# Altium schematic sheet Clock_Led7_23.SchDoc
size A3; SheetNumber: 1; SheetTotal: 1
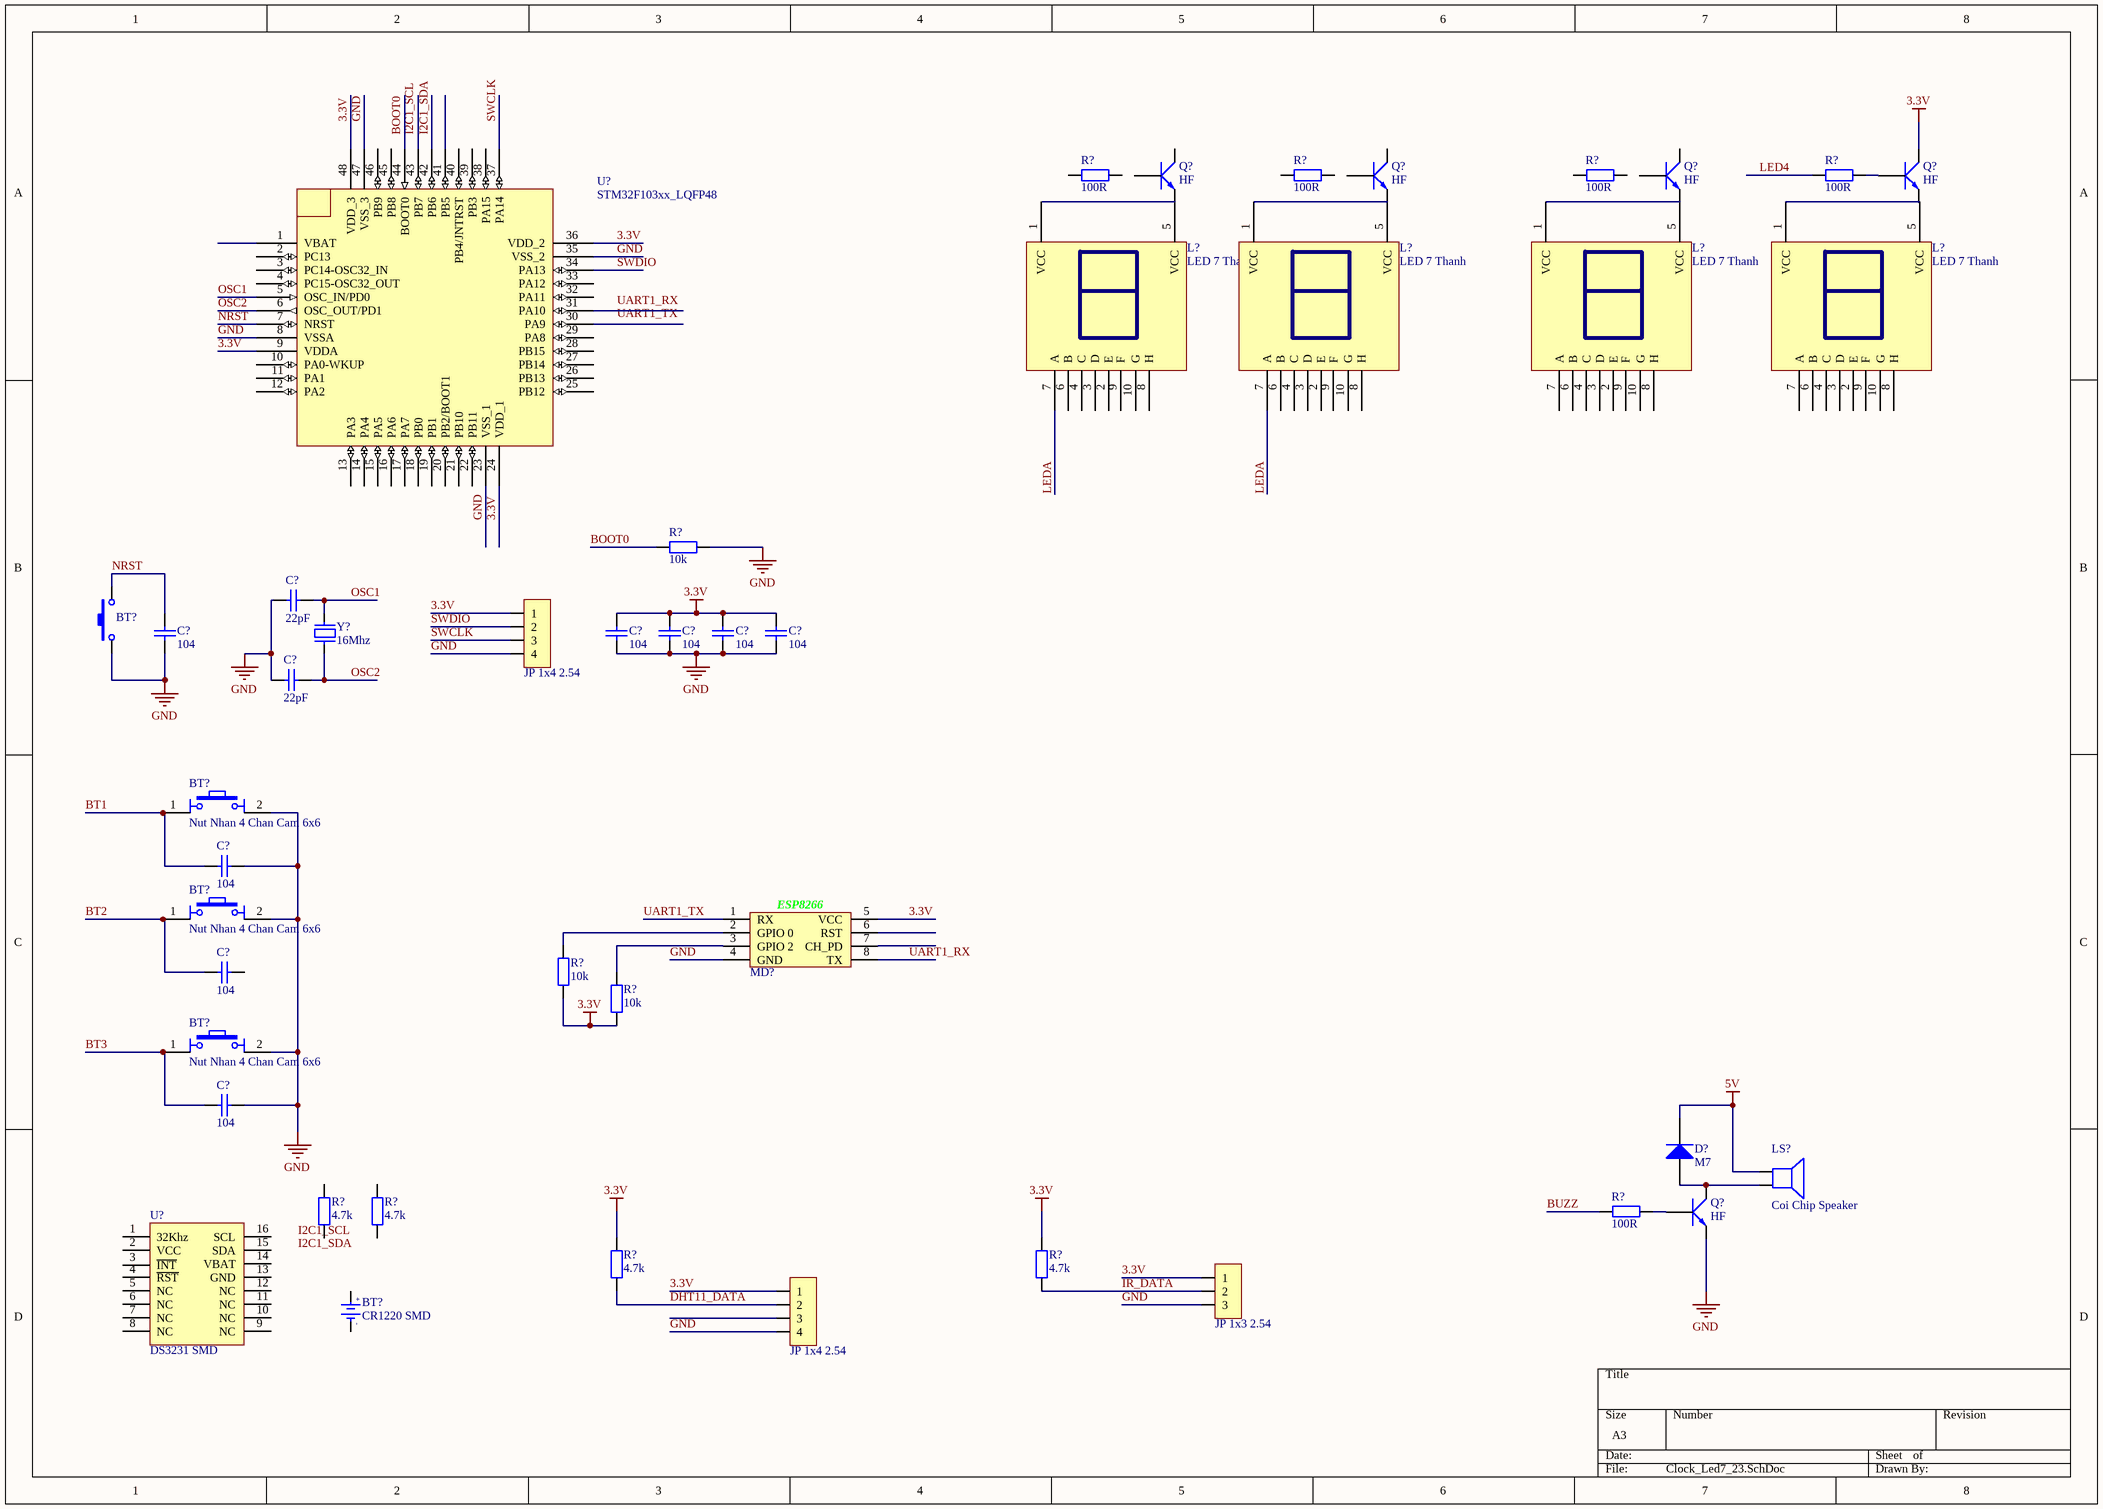
[diagram p0: Clock_Led7_23.SchDoc]

## Parts
(Parts that share a designator on the sheet are numbered #1, #2 ... from top to bottom, then left to right.)
BT?#1  Nut Nhan 2 Chan SMD 3x6x2.5  [Nut Nhan 2 Chan SMD 3x6x2.5]  (value not drawn)
BT?#2  Nut Nhan 4 Chan Cam 6x6  [Nut Nhan 4 Chan Cam 6x6]
BT?#3  Nut Nhan 4 Chan Cam 6x6  [Nut Nhan 4 Chan Cam 6x6]
BT?#4  Nut Nhan 4 Chan Cam 6x6  [Nut Nhan 4 Chan Cam 6x6]
BT?#5  CR1220 SMD  [DE PIN CR1220]
C?#1  22pF  [tu 0805]
C?#2  104  [tu 0805]
C?#3  104  [tu 0805]
C?#4  104  [tu 0805]
C?#5  104  [tu 0805]
C?#6  104  [tu 0805]
C?#7  22pF  [tu 0805]
C?#8  104  [tu 0805]
C?#9  104  [tu 0805]
C?#10  104  [tu 0805]
D?  M7  [DIODE SMA]
JP?#1  JP 1x4 2.54  [JP 1x4 DT]
JP?#2  JP 1x3 2.54  [JP 1x3 CT]
JP?#3  JP 1x4 2.54  [JP 1x4 CT]
L?#1  LED 7 Thanh  [LED7SEG_2.3inch]
L?#2  LED 7 Thanh  [LED7SEG_2.3inch]
L?#3  LED 7 Thanh  [LED7SEG_2.3inch]
L?#4  LED 7 Thanh  [LED7SEG_2.3inch]
LS?  Coi Chip Speaker  [Coi Chip Speacker]
MD?  ESP8266 Module  [ESP2866 Module]  (value not drawn)
Q?#1  HF  [SOT23]
Q?#2  HF  [SOT23]
Q?#3  HF  [SOT23]
Q?#4  HF  [SOT23]
Q?#5  HF  [SOT23]
R?#1  100R  [tro smd 0805]
R?#2  100R  [tro smd 0805]
R?#3  100R  [tro smd 0805]
R?#4  100R  [tro smd 0805]
R?#5  10k  [tro smd 0805]
R?#6  10k  [tro smd 0805]
R?#7  10k  [tro smd 0805]
R?#8  4.7k  [tro smd 0805]
R?#9  4.7k  [tro smd 0805]
R?#10  100R  [tro smd 0805]
R?#11  4.7k  [tro smd 0805]
R?#12  4.7k  [tro smd 0805]
U?#1  STM32F103xx_LQFP48  [STM32_LQPF48]
U?#2  DS3231 SMD  [SOIC 16]
Y?  16Mhz  [Thach Anh 2 chan SMD]

## Nets
3.3V: C?#3.1 C?#4.1 C?#5.1 C?#6.1 JP?#1.1 JP?#2.1 JP?#3.1 MD?.5(VCC) Q?#4.3(C) R?#6.1 R?#7.1 R?#11.2 R?#12.2 U?#1.9(VDDA) U?#1.24(VDD_1) U?#1.36(VDD_2) U?#1.48(VDD_3)
5V: D?.2(K) LS?.1
GND: BT?#1.1 BT?#2.2 BT?#3.2 BT?#4.2 C?#1.2 C?#2.2 C?#3.2 C?#4.2 C?#5.2 C?#6.2 C?#7.1 C?#8.2 C?#10.2 JP?#1.4 JP?#2.3 JP?#3.4 MD?.4(GND) Q?#5.2(E) R?#5.1 U?#1.8(VSSA) U?#1.23(VSS_1) U?#1.35(VSS_2) U?#1.47(VSS_3)
BOOT0: R?#5.2
BT1: BT?#2.1 C?#8.1
BT2: BT?#3.1 C?#9.1
BT3: BT?#4.1 C?#10.1
BUZZ: R?#10.1
DHT11_DATA: JP?#3.2 R?#11.1
I2C1_SDA: U?#1.42(PB6)
IR_DATA: JP?#2.2 R?#12.1
LED4: R?#4.1
LEDA: L?#1.7(A)
NRST: BT?#1.2 C?#2.1 U?#1.7(NRST)
OSC1: C?#1.1 U?#1.5(OSC_IN/PD0) Y?.2
OSC2: C?#7.2 U?#1.6(OSC_OUT/PD1) Y?.1
SWCLK: JP?#1.3 U?#1.37(PA14)
SWDIO: JP?#1.2 U?#1.34(PA13)
UART1_RX: MD?.8(TX)
UART1_TX: MD?.1(RX)
NetD?_1: D?.1(A) LS?.2 Q?#5.3(C)
NetMD?_2: MD?.2(GPIO_0) R?#6.2
NetMD?_3: MD?.3(GPIO_2) R?#7.2
NetQ?#4_1: Q?#4.1(B) R?#4.2
NetQ?#5_1: Q?#5.1(B) R?#10.2

Not connected (* = marked no-connect by the designer): BT?#5 1(+3V) 2(GND); C?#9 2; JP?#3 3; L?#1 1(VCC) 2(E) 3(D) 4(C) 5(VCC) 6(B) 8(H) 9(F) 10(G); L?#2 1(VCC) 2(E) 3(D) 4(C) 5(VCC) 6(B) 7(A) 8(H) 9(F) 10(G); L?#3 1(VCC) 2(E) 3(D) 4(C) 5(VCC) 6(B) 7(A) 8(H) 9(F) 10(G); L?#4 1(VCC) 2(E) 3(D) 4(C) 5(VCC) 6(B) 7(A) 8(H) 9(F) 10(G); MD? 6(RST) 7(CH_PD); Q?#1 1(B) 2(E) 3(C); Q?#2 1(B) 2(E) 3(C); Q?#3 1(B) 2(E) 3(C); Q?#4 2(E); R?#1 1 2; R?#2 1 2; R?#3 1 2; R?#8 1 2; R?#9 1 2; U?#1 1(VBAT) 2(PC13) 3(PC14-OSC32_IN) 4(PC15-OSC32_OUT) 10(PA0-WKUP) 11(PA1) 12(PA2) 13(PA3) 14(PA4) 15(PA5) 16(PA6) 17(PA7) 18(PB0) 19(PB1) 20(PB2/BOOT1) 21(PB10) 22(PB11) 25(PB12) 26(PB13) 27(PB14) 28(PB15) 29(PA8) 30(PA9) 31(PA10) 32(PA11) 33(PA12) 38(PA15) 39(PB3) 40(PB4/JNTRST) 41(PB5) 43(PB7) 44(BOOT0) 45(PB8) 46(PB9); U?#2 1(32Khz) 2(VCC) 3(~{INT}) 4(~{RST}) 5(NC) 6(NC) 7(NC) 8(NC) 9(NC) 10(NC) 11(NC) 12(NC) 13(GND) 14(VBAT) 15(SDA) 16(SCL)

## Notes on the sheet
- Labels drawn without touching a wire or pin: BOOT0, I2C1_SCL, I2C1_SDA, LEDA, UART1_RX, UART1_TX
- (in symbol De pin CR1220 SMD) +; -
- (in symbol ESP8266 Module) ESP8266

## Library data of the parts
BT?#1 = Nut Nhan 2 Chan SMD 3x6x2.5: Ma_Hang: MH001036; Ten: Nút Nhấn 2 Chân 3x6x2.5MM SMD
BT?#2-BT?#4 = Nut Nhan 4 Chan Cam 6x6: Nut Nhan 4 Chan 6x6mm; Ten: Nút Nhấn 4 Chân 6x6x5MM DIP; Ma_Hang: MH004584
BT?#5 = De pin CR1220 SMD: Ten: Đế PIN CR1220 SMD; Ma_Hang: MH000833
C?#1 C?#7 = Tu 0805 22pF 50V 10%: Dán; Don_Vi: Con; So_Chan: 2; Ten_Linh_Kien: Tụ 0805 22P 10% 50V; Ma_Hang: MH004560; Chung_Loai: Dán; Kieu_Chan: *
C?#2-C?#6 C?#8-C?#10 = Tu 0805 104 50V 10%: Dán; Don_Vi: Con; So_Chan: 2; Ten_Linh_Kien: Tụ 0805 104-100nF 10% 50V; Ma_Hang: MH004551; Chung_Loai: Dán; Kieu_Chan: *
D? = Diode M7 ( 4007 ): Dán; Don_Vi: Con; Ten_Linh_Kien: Diode M7 1N4007 SMD 1A 1000V; Ma_Hang: MH000944; Chung_Loai: Dán; Ghi_Chu: *
JP?#1 = JP 1x4 2.54 Duc Thang: Cắm; Ten_Linh_Kien: Jump Đơn Đực 2.54MM 1x40P Thẳng 11MM; Don_Vi: Con; Ma_Hang: MH000903; Ghi_Chu: *; Kieu_Chan: *; Chung_Loai: Cắm
JP?#2 = JP 1x3 2.54 Cai Thang: Cắm; Ten_Linh_Kien: Jump Đơn Cái 2.54MM 1x20P Thẳng; Don_Vi: Con; Ma_Hang: MH004006; Ghi_Chu: *; Kieu_Chan: *; Chung_Loai: Cắm
JP?#3 = JP 1x4 2.54 Cai Thang: Cắm; Ten_Linh_Kien: Jump Đơn Cái 2.54MM 1x20P Thẳng; Don_Vi: Con; Ma_Hang: MH004006; Ghi_Chu: *; Kieu_Chan: *; Chung_Loai: Cắm
L?#1-L?#4 = LED 7x1 2.3inch Anot: Dán; Don_Vi: Con; Ma_Hang: MH000901; Ten_Linh_Kien: Led 7 2.3 1 Số Anot (Sáng Đỏ); Ghi_Chu: *; Kieu_Chan: *; Chung_Loai: Dán
LS? = Coi Chip Speaker: Còi chip
Q?#1-Q?#5 = C1815 HF SMD: NPN transistor; Value: C9014
R?#1-R?#4 R?#10 = Tro 0805 5% 100R: Dán; Don_Vi: Con; So_Chan: 2; Ten_Linh_Kien: Trở 0805 5% 100R; Ma_Hang: MH005251; Chung_Loai: Dán; Kieu_Chan: *
R?#5-R?#7 = Tro 0805 5% 10k: Dán; Don_Vi: Con; So_Chan: 2; Ten_Linh_Kien: Trở 0805 5% 10k; Ma_Hang: MH005239; Chung_Loai: Dán; Kieu_Chan: *
R?#8 R?#9 R?#11 R?#12 = Tro 0805 5% 4.7k: Dán; Don_Vi: Con; So_Chan: 2; Ten_Linh_Kien: Trở 0805 5% 4.7k; Ma_Hang: MH005307; Chung_Loai: Dán; Kieu_Chan: *
U?#2 = DS3231 SMD: SOIC
Y? = Thach Anh 2 chan SMD: Crystal For all Crystal 2pin.; Value: 4Mhz
U?#1 = STM32F103xx_LQFP48: Published: 30-May-2008; DatasheetVersion: rev6, Mar-2008; PackageVersion: Mar-2008; PackageReference: LQFP48; Publisher: Altium Limited; PackageDescription: 48-Pin Low-Profile Quad Flat Pack, 7 x 7 mm Body, 0.5 mm Pitch (LQFP48); ComponentLink1Description: Manufacturer Link; ComponentLink1URL: www.st.com/stm32; ComponentLink2Description: Datasheet; ComponentLink2URL: http://www.st.com/stonline/products/literature/ds/13587.pdf